# EAGLE design smog_v1_1_brain (EAGLE 7.3.0)

## Sheet 1 of 2
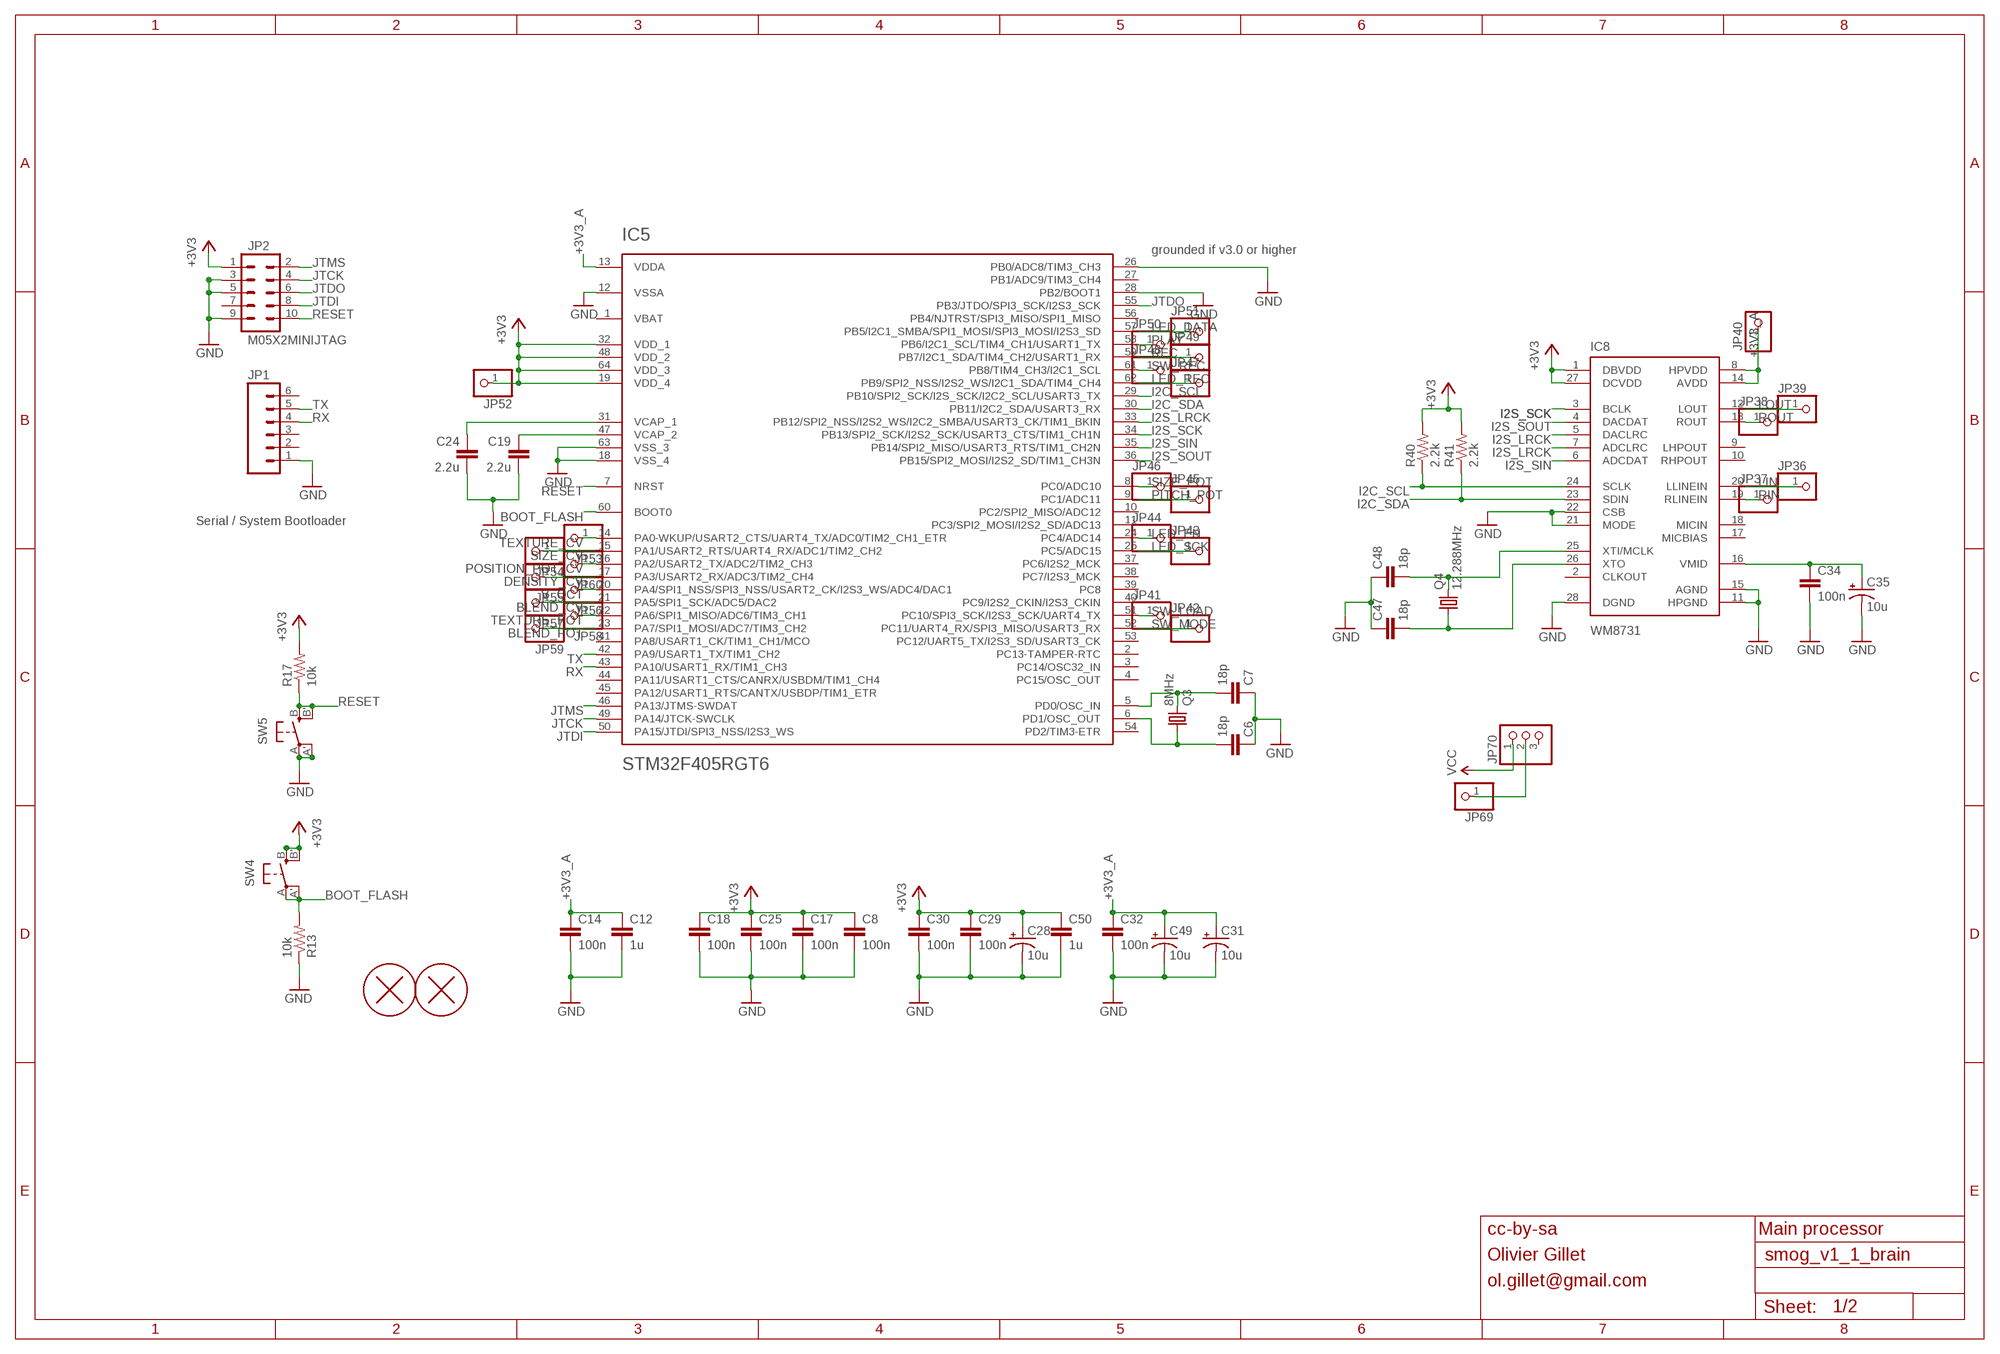
[diagram p0: schematic, sheet 1]

### Parts
C6  18p  CAPACITOR  [RESISTOR_0603]
C7  18p  CAPACITOR  [RESISTOR_0603]
C8  100n  CAPACITOR  [RESISTOR_0603]
C12  1u  CAPACITOR  [RESISTOR_0603]
C14  100n  CAPACITOR  [RESISTOR_0603]
C17  100n  CAPACITOR  [RESISTOR_0603]
C18  100n  CAPACITOR  [RESISTOR_0603]
C19  2.2u  CAPACITOR  [RESISTOR_0603]
C24  2.2u  CAPACITOR  [RESISTOR_0603]
C25  100n  CAPACITOR  [RESISTOR_0603]
C28  10u  CAP_POL  [PANASONIC_B]
C29  100n  CAPACITOR  [RESISTOR_0603]
C30  100n  CAPACITOR  [RESISTOR_0603]
C31  10u  CAP_POL  [PANASONIC_B]
C32  100n  CAPACITOR  [RESISTOR_0603]
C34  100n  CAPACITOR  [RESISTOR_0603]
C35  10u  CAP_POL  [PANASONIC_B]
C47  18p  CAPACITOR  [RESISTOR_0603]
C48  18p  CAPACITOR  [RESISTOR_0603]
C49  10u  CAP_POL  [PANASONIC_B]
C50  1u  CAPACITOR  [RESISTOR_0603]
H1  PCB_SCREW  [PCB_SCREW]
H2  PCB_SCREW  [PCB_SCREW]
IC5  STM32F405RGT6  STM32F20X  [TQFP-10X10-64]
IC8  WM8731  [SSOP28]
JP1  M06SIP  [1X06]
JP2  M05X2MINIJTAG  [2X5-1.27]
JP36  PINHD-1X1  [1X01]
JP37  PINHD-1X1  [1X01]
JP38  PINHD-1X1  [1X01]
JP39  PINHD-1X1  [1X01]
JP40  PINHD-1X1  [1X01]
JP41  PINHD-1X1  [1X01]
JP42  PINHD-1X1  [1X01]
JP43  PINHD-1X1  [1X01]
JP44  PINHD-1X1  [1X01]
JP45  PINHD-1X1  [1X01]
JP46  PINHD-1X1  [1X01]
JP47  PINHD-1X1  [1X01]
JP48  PINHD-1X1  [1X01]
JP49  PINHD-1X1  [1X01]
JP50  PINHD-1X1  [1X01]
JP51  PINHD-1X1  [1X01]
JP52  PINHD-1X1  [1X01]
JP53  PINHD-1X1  [1X01]
JP54  PINHD-1X1  [1X01]
JP55  PINHD-1X1  [1X01]
JP56  PINHD-1X1  [1X01]
JP57  PINHD-1X1  [1X01]
JP58  PINHD-1X1  [1X01]
JP59  PINHD-1X1  [1X01]
JP60  PINHD-1X1  [1X01]
JP69  PINHD-1X1  [1X01]
JP70  PINHD-1X3  [1X03]
Q3  8MHz  CRYSTAL  [HC49UP]
Q4  12.288MHz  CRYSTAL  [HC49UP]
R13  10k  RESISTOR  [RESISTOR_0603]
R17  10k  RESISTOR  [RESISTOR_0603]
R40  2.2k  RESISTOR  [RESISTOR_0603]
R41  2.2k  RESISTOR  [RESISTOR_0603]
SW4  EVQQ2  [EVQ-Q2]
SW5  EVQQ2  [EVQ-Q2]

### Nets
+3V3 [mwide]: C8.1 C17.1 C18.1 C25.1 C28.+ C29.1 C30.1 C50.1 IC5.19(VDD_4) IC5.32(VDD_1) IC5.48(VDD_2) IC5.64(VDD_3) IC8.1(DBVDD) IC8.27(DCVDD) JP2.1 JP52.1 R17.2 R40.2 R41.2 SW4.B'(S1) SW4.B(S) ; also sheet 2
+3V3_A [mwide]: C12.1 C14.1 C31.+ C32.1 C49.+ IC5.13(VDDA) IC8.8(HPVDD) IC8.14(AVDD) JP40.1 ; also sheet 2
BLEND_CV: IC5.21(PA5/SPI1_SCK/ADC5/DAC2) JP57.1
BLEND_POT: IC5.23(PA7/SPI1_MOSI/ADC7/TIM3_CH2) JP59.1
BOOT_FLASH: IC5.60(BOOT0) R13.2 SW4.A'(P1) SW4.A(P)
DENSITY_CV: IC5.17(PA3/USART2_RX/ADC3/TIM2_CH4) JP55.1
GND: C6.1 C7.1 C8.2 C12.2 C14.2 C17.2 C18.2 C19.2 C24.2 C25.2 C28.- C29.2 C30.2 C31.- C32.2 C34.2 C35.- C47.1 C48.1 C49.- C50.2 IC5.12(VSSA) IC5.18(VSS_4) IC5.26(PB0/ADC8/TIM3_CH3) IC5.28(PB2/BOOT1) IC5.63(VSS_3) IC8.11(HPGND) IC8.15(AGND) IC8.21(MODE) IC8.22(CSB) IC8.28(DGND) JP1.1 JP2.3 JP2.5 JP2.9 R13.1 SW5.A'(P1) SW5.A(P) ; also sheet 2
I2C_SCL: IC5.29(PB10/SPI2_SCK/I2S_SCK/I2C2_SCL/USART3_TX) IC8.24(SCLK) R40.1
I2C_SDA: IC5.30(PB11/I2C2_SDA/USART3_RX) IC8.23(SDIN) R41.1
I2S_LRCK: IC5.33(PB12/SPI2_NSS/I2S2_WS/I2C2_SMBA/USART3_CK/TIM1_BKIN) IC8.5(DACLRC) IC8.7(ADCLRC)
I2S_SCK: IC5.34(PB13/SPI2_SCK/I2S2_SCK/USART3_CTS/TIM1_CH1N) IC8.3(BCLK)
I2S_SIN: IC5.35(PB14/SPI2_MISO/USART3_RTS/TIM1_CH2N) IC8.6(ADCDAT)
I2S_SOUT: IC5.36(PB15/SPI2_MOSI/I2S2_SD/TIM1_CH3N) IC8.4(DACDAT)
JTCK: IC5.49(PA14/JTCK-SWCLK) JP2.4
JTDI: IC5.50(PA15/JTDI/SPI3_NSS/I2S3_WS) JP2.8
JTDO: IC5.55(PB3/JTDO/SPI3_SCK/I2S3_SCK) JP2.6
JTMS: IC5.46(PA13/JTMS-SWDAT) JP2.2
LED_DATA: IC5.57(PB5/I2C1_SMBA/SPI1_MOSI/SPI3_MOSI/I2S3_SD) JP51.1
LED_EN: IC5.24(PC4/ADC14) JP44.1
LED_REC: IC5.62(PB9/SPI2_NSS/I2S2_WS/I2C1_SDA/TIM4_CH4) JP47.1
LED_SCK: IC5.25(PC5/ADC15) JP43.1
LIN: IC8.20(LLINEIN) JP36.1
LOUT: IC8.12(LOUT) JP39.1
N$7: C7.2 IC5.5(PD0/OSC_IN) Q3.2
N$8: C6.2 IC5.6(PD1/OSC_OUT) Q3.1
N$13: C19.1 IC5.47(VCAP_2)
N$17: C34.1 C35.+ IC8.16(VMID)
N$19: C24.1 IC5.31(VCAP_1)
N$59: C47.2 IC8.26(XTO) Q4.1
N$60: C48.2 IC8.25(XTI/MCLK) Q4.2
N$74: JP69.1 JP70.2
PITCH_POT: IC5.9(PC1/ADC11) JP45.1
PLAY: IC5.58(PB6/I2C1_SCL/TIM4_CH1/USART1_TX) JP50.1
POSITION_POT_CV: IC5.16(PA2/USART2_TX/ADC2/TIM2_CH3) JP60.1
REC: IC5.59(PB7/I2C1_SDA/TIM4_CH2/USART1_RX) JP49.1
RESET: IC5.7(NRST) JP2.10 R17.1 SW5.B'(S1) SW5.B(S)
RIN: IC8.19(RLINEIN) JP37.1
ROUT: IC8.13(ROUT) JP38.1
RX: IC5.43(PA10/USART1_RX/TIM1_CH3) JP1.4
SIZE_CV: IC5.15(PA1/USART2_RTS/UART4_RX/ADC1/TIM2_CH2) JP54.1
SIZE_POT: IC5.8(PC0/ADC10) JP46.1
SW_LOAD: IC5.51(PC10/SPI3_SCK/I2S3_SCK/UART4_TX) JP41.1
SW_MODE: IC5.52(PC11/UART4_RX/SPI3_MISO/USART3_RX) JP42.1
SW_REC: IC5.61(PB8/TIM4_CH3/I2C1_SCL) JP48.1
TEXTURE_CV: IC5.14(PA0-WKUP/USART2_CTS/UART4_TX/ADC0/TIM2_CH1_ETR) JP53.1
TEXTURE_POT: IC5.22(PA6/SPI1_MISO/ADC6/TIM3_CH1) JP58.1
TX: IC5.42(PA9/USART1_TX/TIM1_CH2) JP1.5
V_OCT: IC5.20(PA4/SPI1_NSS/SPI3_NSS/USART2_CK/I2S3_WS/ADC4/DAC1) JP56.1
VCC [wide]: JP70.1 ; also sheet 2
Unconnected: IC5.2(PC13-TAMPER-RTC) IC5.3(PC14/OSC32_IN) IC5.4(PC15/OSC_OUT) IC5.10(PC2/SPI2_MISO/ADC12) IC5.11(PC3/SPI2_MOSI/I2S2_SD/ADC13) IC5.27(PB1/ADC9/TIM3_CH4) IC5.37(PC6/I2S2_MCK) IC5.38(PC7/I2S3_MCK) IC5.39(PC8) IC5.40(PC9/I2S2_CKIN/I2S3_CKIN) IC5.41(PA8/USART1_CK/TIM1_CH1/MCO) IC5.44(PA11/USART1_CTS/CANRX/USBDM/TIM1_CH4) IC5.45(PA12/USART1_RTS/CANTX/USBDP/TIM1_ETR) IC5.53(PC12/UART5_TX/I2S3_SD/USART3_CK) IC5.54(PD2/TIM3-ETR) IC5.56(PB4/NJTRST/SPI3_MISO/SPI1_MISO) IC8.2(CLKOUT) IC8.9(LHPOUT) IC8.10(RHPOUT) IC8.17(MICBIAS) IC8.18(MICIN) JP1.2 JP1.3 JP1.6 JP2.7 JP70.3

### Notes on the sheet
- grounded if v3.0 or higher
- Serial / System Bootloader
- cc-by-sa | Main processor
- Olivier Gillet
- ol.gillet@gmail.com

## Sheet 2 of 2
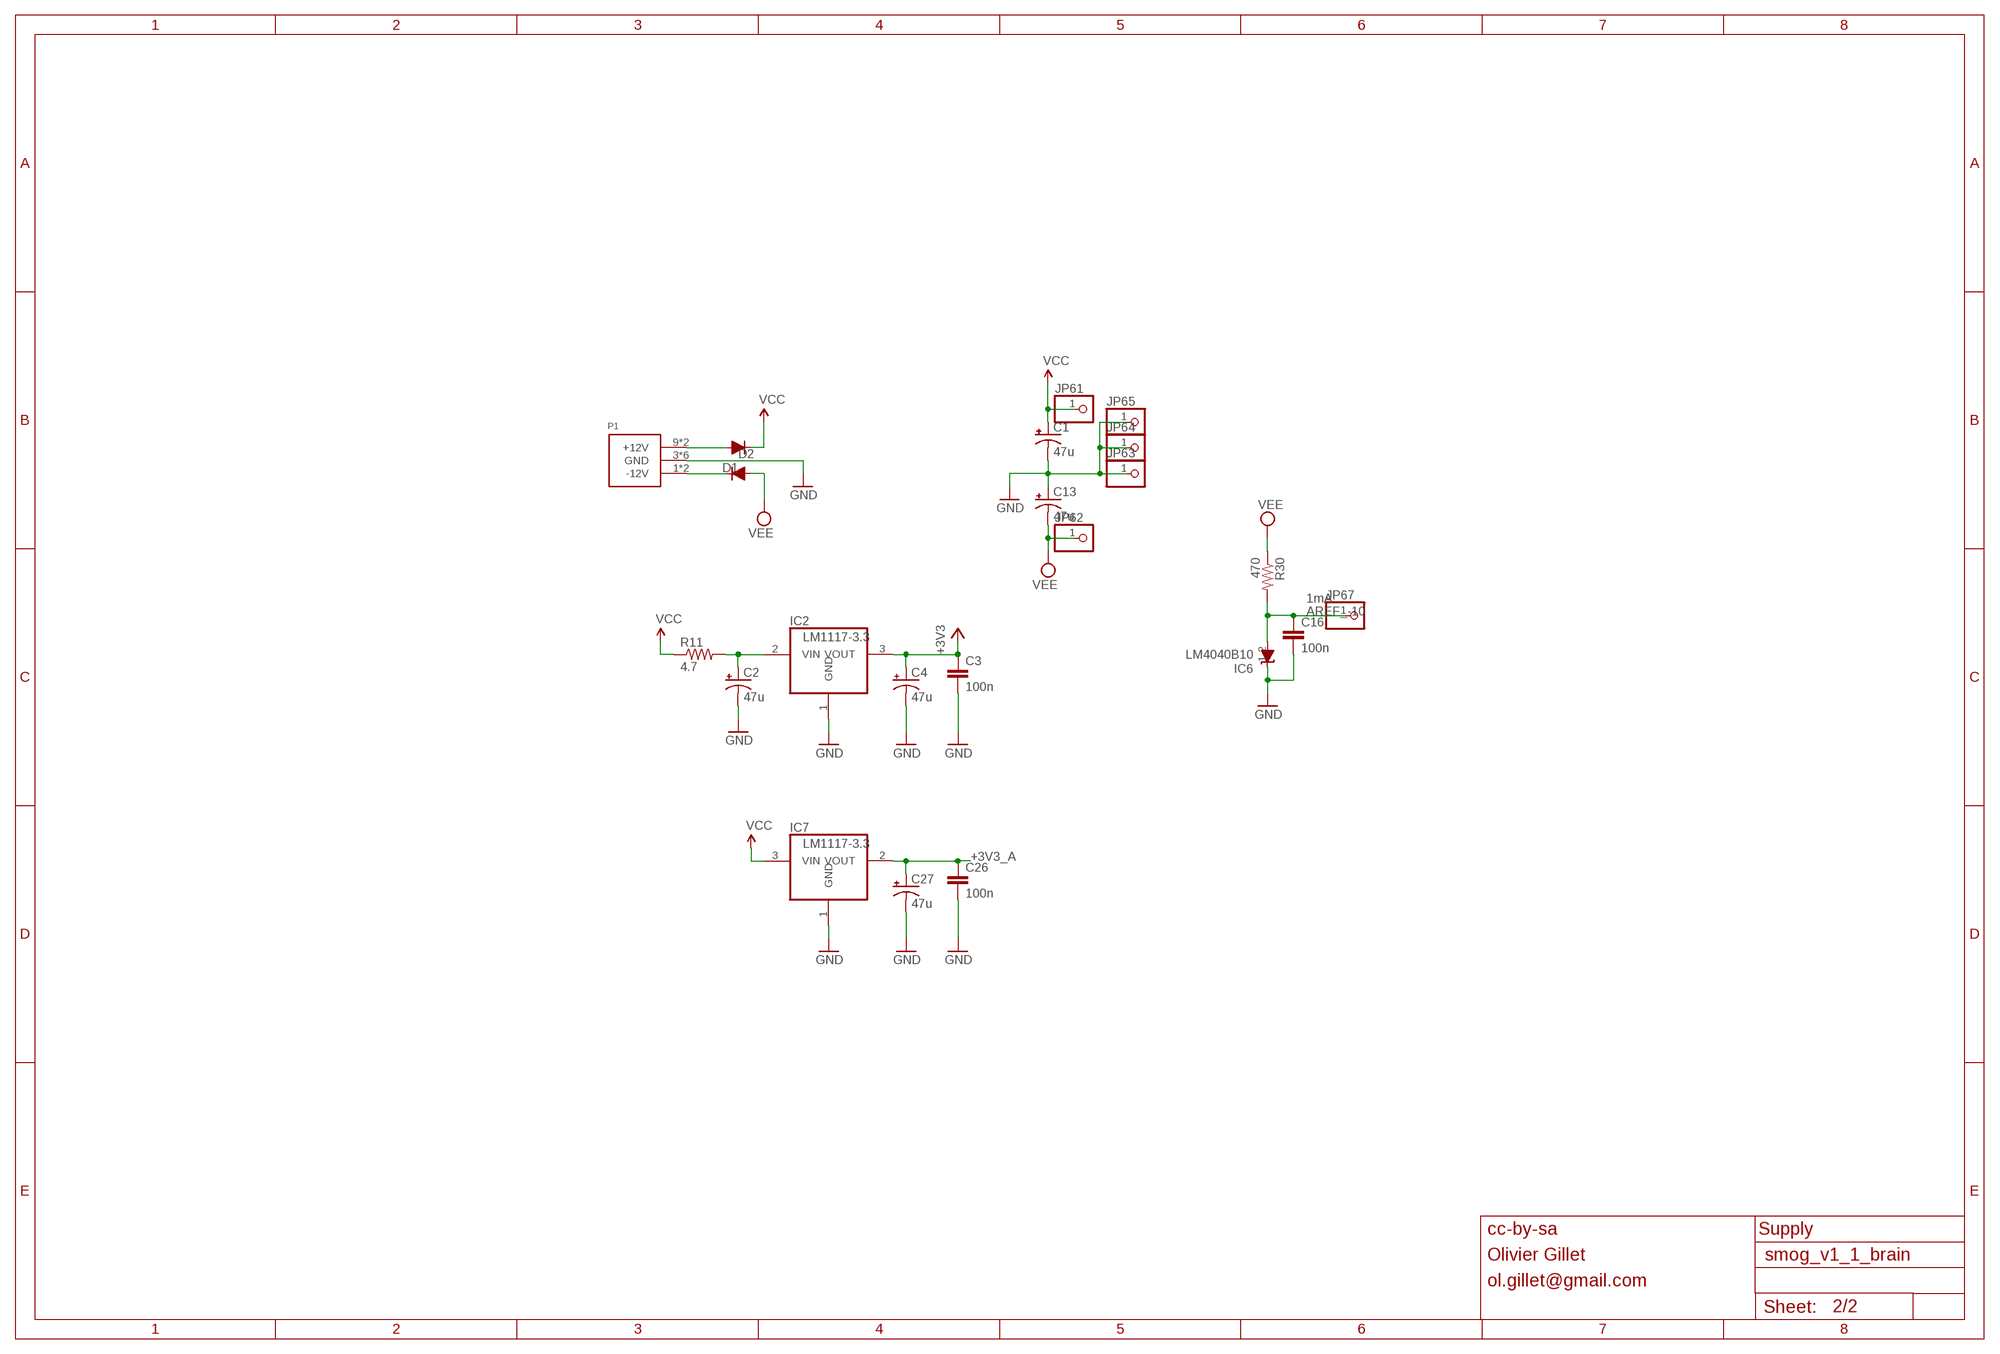
[diagram p1: schematic, sheet 2]

### Parts
C1  47u  CAP_POLD  [PANASONIC_D]
C2  47u  CAP_POLD  [PANASONIC_D]
C3  100n  CAPACITOR  [RESISTOR_0603]
C4  47u  CAP_POLD  [PANASONIC_D]
C13  47u  CAP_POLD  [PANASONIC_D]
C16  100n  CAPACITOR  [RESISTOR_0603]
C26  100n  CAPACITOR  [RESISTOR_0603]
C27  47u  CAP_POLD  [PANASONIC_D]
D1  1N5819HW  DIODE  [SOD123]
D2  1N5819HW  DIODE  [SOD123]
IC2  LM1117-3.3  REG1117T  [TO252]
IC6  LM4040B10  LM4040SOT23  [SOT23]
IC7  LM1117-3.3  REG1117  [SOT223]
JP61  PINHD-1X1  [1X01]
JP62  PINHD-1X1  [1X01]
JP63  PINHD-1X1  [1X01]
JP64  PINHD-1X1  [1X01]
JP65  PINHD-1X1  [1X01]
JP67  PINHD-1X1  [1X01]
P1  POWER_SIMPLE10  [POWER_10]
R11  4.7  RESISTOR  [RESISTOR_0603]
R30  470  RESISTOR  [RESISTOR_0603]

### Nets
+3V3 [mwide]: C3.1 C4.+ IC2.3(VOUT) ; also sheet 1
+3V3_A [mwide]: C26.1 C27.+ IC7.2(VOUT) ; also sheet 1
AREF_-10: C16.1 IC6.2(A) JP67.1 R30.2
GND: C1.- C2.- C3.2 C4.- C13.+ C16.2 C26.2 C27.- IC2.1(GND) IC6.1(C) IC7.1(GND) JP63.1 JP64.1 JP65.1 P1.3(GND) P1.4(GND) P1.5(GND) P1.6(GND) P1.7(GND) P1.8(GND) ; also sheet 1
N$1 [wide]: D1.+ P1.9(+12V) P1.10(+12V)
N$2 [wide]: D2.- P1.1(-12V) P1.2(-12V)
N$55 [wide]: C2.+ IC2.2(VIN) R11.2
VCC [wide]: C1.+ D1.- IC7.3(VIN) JP61.1 R11.1 ; also sheet 1
VEE [wide]: C13.- D2.+ JP62.1 R30.1

### Notes on the sheet
- 1mA
- cc-by-sa | Supply
- Olivier Gillet
- ol.gillet@gmail.com

## Power pins joined to a net without a drawn wire
VBAT: IC5.1(VBAT)

## Library data of the parts
C1 C2 C4 C13 C27 C28 C31 C35 C49 = parts_aman:CAP_POL
C3 C6-C8 C12 C14 C16-C19 C24-C26 C29 C30 C32 C34 C47 C48 C50 = parts_aman:CAPACITOR
D1 D2 = parts_aman:DIODE
H1 H2 = parts_aman:PCB_SCREW
IC2 IC7 = og-vreg:REG1117: 800mA and 1A Low Dropout (LDO) Positive Regulator 1.8V, 2.5V, 2.85V, 3.3V, 5V, and Adj
IC5 = og-stm32f2:STM32F20X
IC6 = parts_aman:LM4040
IC8 = og-dac:WM8731
JP1 = SparkFun:M06: Header 6 Standard 6-pin 0.1" header. Use with straight break away headers (SKU : PRT-00116), right angle break away headers (PRT-00553), swiss pins (PRT-00743), machine pins (PRT-00117), and female headers (PRT-00115). Molex polarized connector foot print use with SKU : PRT-08094 with associated crimp pins and housings. NOTES ON THE VARIANTS LOCK and LOCK_LONGPADS... This footprint was designed to help hold the alignment of a through-hole component (i.e. 6-pin header) while soldering it into place. You may notice that each hole has been shifted either up or down by 0.005 of an inch from it's more standard position (which is a perfectly straight line). This slight alteration caused the pins (the squares in the middle) to touch the edges of the holes. Because they are alternating, it causes a "brace" to hold the component in place. 0.005 has proven to be the perfect amount of "off-center" position when using our standard breakaway headers. Although looks a little odd when you look at the bare footprint, once you have a header in there, the alteration is very hard to notice. Also, if you push a header all the way into place, it is covered up entirely on the bottom side. This idea of altering the position of holes to aid alignment will be further integrated into the Sparkfun Library for other footprints. It can help hold any component with 3 or more connection pins.
JP2 = og-header:M05X2: Header 5x2 Standard 10-pin dual row 0.1" header. Commonly used with AVR-ISP. Use with Spark Fun Electronics SKU: PRT-00778
JP36-JP65 JP67 JP69 = parts_aman:PINHD-1X1: PIN HEADER
JP70 = parts_aman:PINHD-1X3: PIN HEADER
P1 = parts_aman:POWER_SIMPLE
Q3 Q4 = parts_aman:CRYSTAL
R11 R13 R17 R30 R40 R41 = parts_aman:RESISTOR
SW4 SW5 = adafruit:EVQQ2: SMT 6mm switch, EVQQ2 series http://www.ladyada.net/library/eagle

## Net classes
0 default: width 0.152 mm, drill 0.305 mm, clearance 0.152 mm
1 mwide: width 0.229 mm, drill 0.305 mm, clearance 0.152 mm
2 wide: width 0.305 mm, drill 0.305 mm, clearance 0.152 mm

## Board
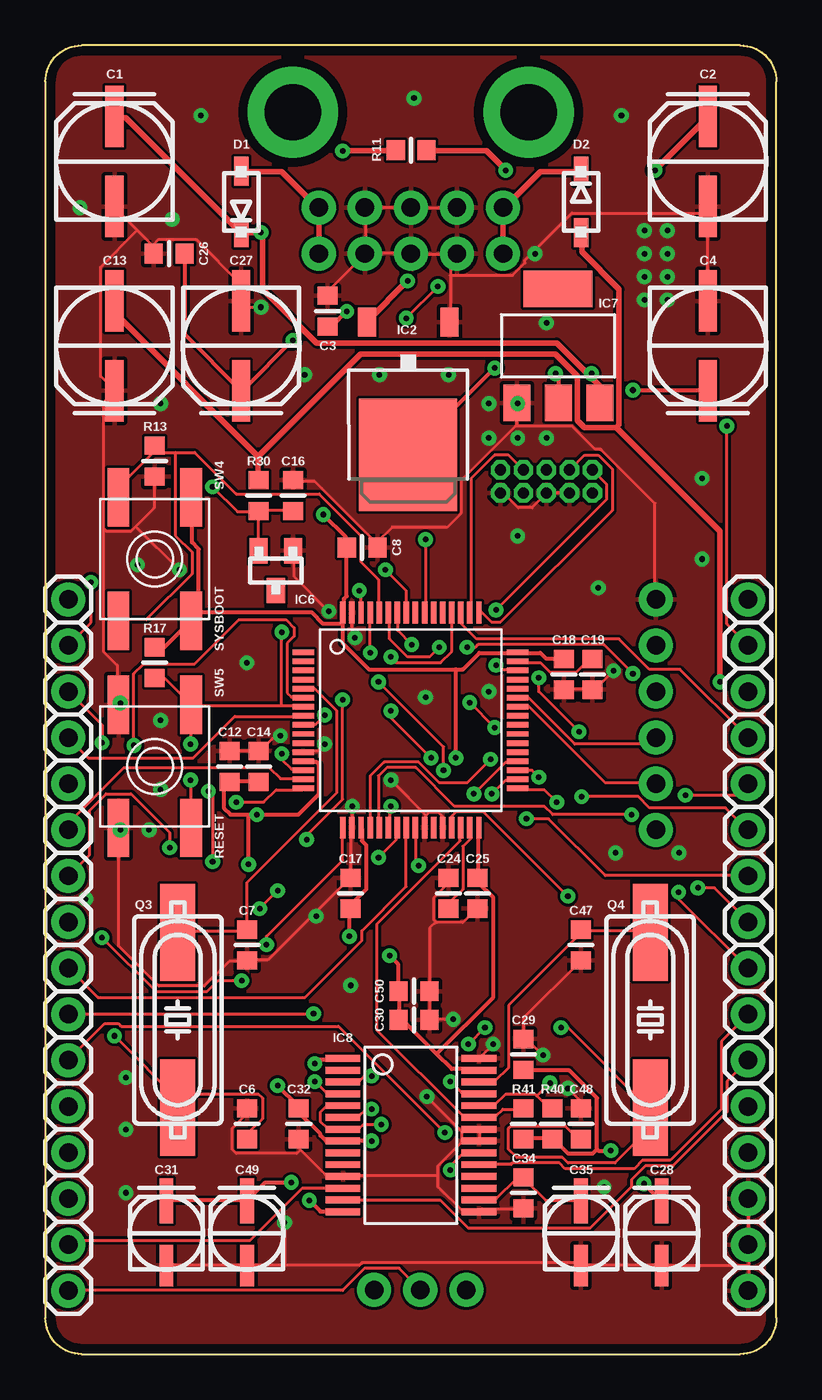
[diagram p2: board, top side]
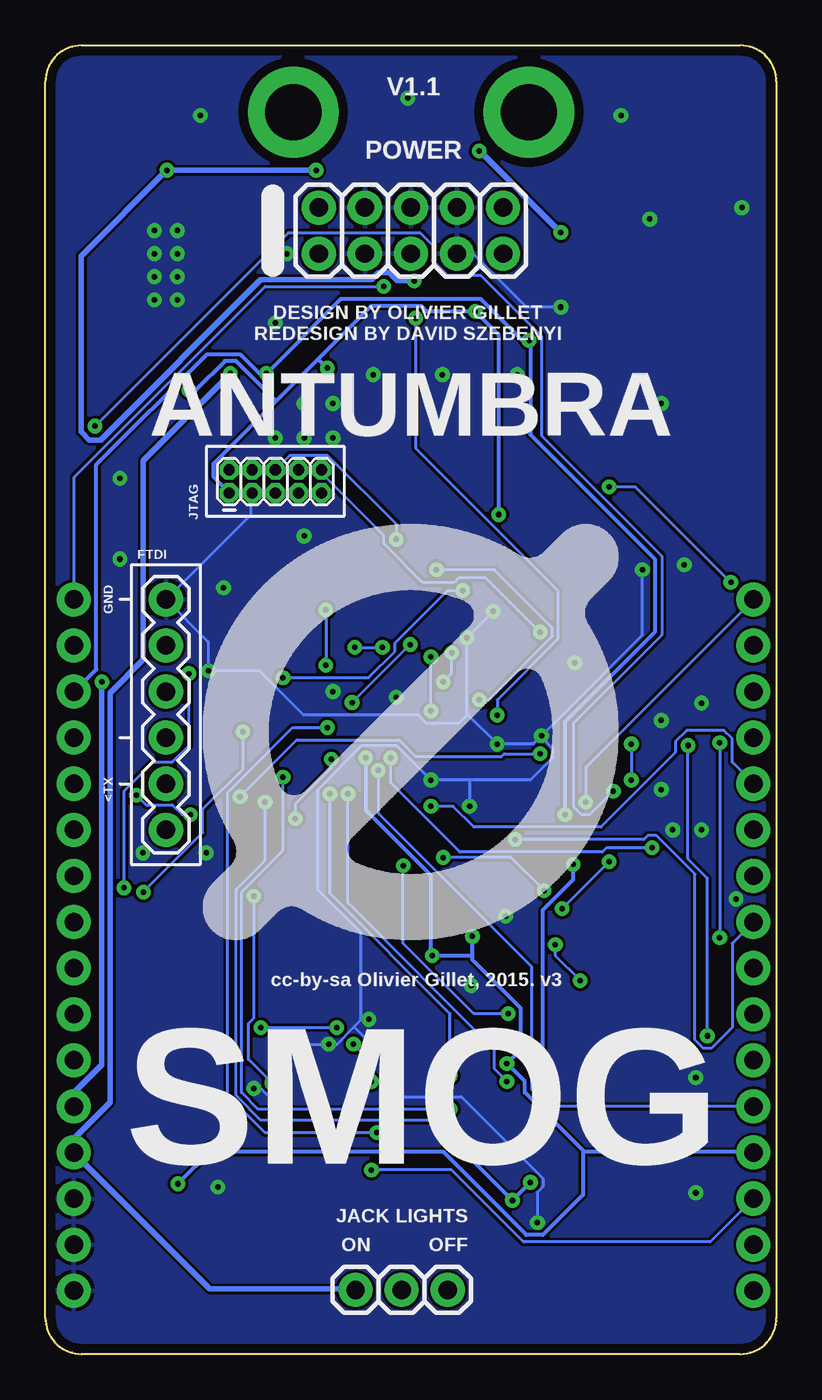
[diagram p3: board, bottom side, seen from below]

Size 40.3 x 72.12 mm. Coordinates in mm from the lower left corner, seen from the top.
Outline: 2,0 38.3,0 arc90 40.3,2 40.3,70.12 arc90 38.3,72.12 2,72.12 arc90 0,70.12 0,2 arc90 2,0
Copper layers (1*16): Top 0.035mm / dielectric 1.5mm / Bottom 0.035mm
Design rules "PCBCart-Standard": minimum track width 6mil, minimum drill 12mil, track to track 6mil, track to pad 6mil, pad to pad 6mil, via to via 6mil, smd to smd 6mil, copper to edge 20mil, drill to drill 8mil, minimum pad ring 8mil, minimum via ring 10mil, stop-mask expansion 3mil, vias tented up to drill 25mil, thermal gap 8mil

### Footprints (pad centres in the part's own frame; a part is rotated, then mirrored left to right if it is on the bottom)
PANASONIC_D = smd 3.4 x 1: + 2.478,0; - -2.478,0
RESISTOR_0603 = smd 1 x 1.1: 1 -0.85,0; 2 0.85,0
PANASONIC_B = smd 2.464 x 0.762: + 1.778,0 | smd 2.286 x 0.762: - -1.778,0
SOD123 = smd 1.6 x 0.8: + 1.7,0; - -1.7,0
PCB_SCREW = drill 3.1 pad 5: P$1 0,0
TO252 = smd 1 x 1.6: 1 -2.28,-4.8; 2 2.28,-4.8 | smd 5.4 x 6.2: 3 0,2.5
TQFP-10X10-64 = smd 1.2 x 0.3: 1 -5.936,3.75; 2 -5.936,3.25; 3 -5.936,2.75; 4 -5.936,2.25; 5 -5.936,1.75; 6 -5.936,1.25; 7 -5.936,0.75; 8 -5.936,0.25; 9 -5.936,-0.25; 10 -5.936,-0.75; 11 -5.936,-1.25; 12 -5.936,-1.75; 13 -5.936,-2.25; 14 -5.936,-2.75; 15 -5.936,-3.25; 16 -5.936,-3.75; 33 5.886,-3.75; 34 5.886,-3.25; 35 5.886,-2.75; 36 5.886,-2.25; 37 5.886,-1.75; 38 5.886,-1.25; 39 5.886,-0.75; 40 5.886,-0.25; 41 5.886,0.25; 42 5.886,0.75; 43 5.886,1.25; 44 5.886,1.75; 45 5.886,2.25; 46 5.886,2.75; 47 5.886,3.25; 48 5.886,3.75 | smd 0.3 x 1.2: 17 -3.75,-5.911; 18 -3.25,-5.911; 19 -2.75,-5.911; 20 -2.25,-5.911; 21 -1.75,-5.911; 22 -1.25,-5.911; 23 -0.75,-5.911; 24 -0.25,-5.911; 25 0.25,-5.911; 26 0.75,-5.911; 27 1.25,-5.911; 28 1.75,-5.911; 29 2.25,-5.911; 30 2.75,-5.911; 31 3.25,-5.911; 32 3.75,-5.911; 49 3.75,5.936; 50 3.25,5.936; 51 2.75,5.936; 52 2.25,5.936; 53 1.75,5.936; 54 1.25,5.936; 55 0.75,5.936; 56 0.25,5.936; 57 -0.25,5.936; 58 -0.75,5.936; 59 -1.25,5.936; 60 -1.75,5.936; 61 -2.25,5.936; 62 -2.75,5.936; 63 -3.25,5.936; 64 -3.75,5.936
SOT23 = smd 1 x 1.4: 1 -0.95,-1.1; 2 0.95,-1.1; 3 0,1.1
SOT223 = smd 1.499 x 2.007: 1 -2.261,-3.15; 2 0.025,-3.15; 3 2.311,-3.15 | smd 3.81 x 2.007: 4 0,3.15
SSOP28 = smd 0.381 x 1.905: 1 -4.55,-3.752; 2 -3.9,-3.752; 3 -3.25,-3.752; 4 -2.6,-3.752; 5 -1.95,-3.752; 6 -1.3,-3.752; 7 -0.65,-3.752; 8 0,-3.752; 9 0.65,-3.752; 10 1.3,-3.752; 11 1.95,-3.752; 12 2.6,-3.752; 13 3.25,-3.752; 14 3.9,-3.752; 15 3.9,3.752; 16 3.25,3.752; 17 2.6,3.752; 18 1.95,3.752; 19 1.3,3.752; 20 0.65,3.752; 21 0,3.752; 22 -0.65,3.752; 23 -1.3,3.752; 24 -1.95,3.752; 25 -2.6,3.752; 26 -3.25,3.752; 27 -3.9,3.752; 28 -4.55,3.752
1X06 = drill 1.016 pad 1.88: 1 0,0; 2 2.54,0; 3 5.08,0; 4 7.62,0; 5 10.16,0; 6 12.7,0
2X5-1.27 = drill 0.61 pad 1.067 octagon: 1 -1.27,3.81; 2 0,3.81; 3 -1.27,2.54; 4 0,2.54; 5 -1.27,1.27; 6 0,1.27; 7 -1.27,0; 8 0,0; 9 -1.27,-1.27; 10 0,-1.27
1X01 = drill 1.016 pad 1.88: 1 0,0
1X03 = drill 1.016 pad 1.88: 1 -2.54,0; 2 0,0; 3 2.54,0
POWER_10 = drill 1.016 pad 1.88: 1 -5.08,-1.27; 2 -5.08,1.27; 3 -2.54,-1.27; 4 -2.54,1.27; 5 0,-1.27; 6 0,1.27; 7 2.54,-1.27; 8 2.54,1.27; 9 5.08,-1.27; 10 5.08,1.27
HC49UP = smd 5.334 x 1.93: 1 -4.826,0; 2 4.826,0
EVQ-Q2 = smd 3.2 x 1.2: A -3.4,-2; A' 3.4,-2; B -3.4,2; B' 3.4,2

### Placement (x,y rotation side)
C1  3.81,65.72 90 top
C2  36.51,65.72 90 top
C3  15.56,57.47 90 top
C4  36.51,55.56 270 top
C6  11.11,12.7 270 top
C7  11.11,22.54 90 top
C8  17.46,44.45 0 top
C12  10.16,32.39 90 top
C13  3.81,55.56 270 top
C14  11.75,32.39 90 top
C16  13.65,47.31 90 top
C17  16.83,25.4 90 top
C18  28.57,37.47 270 top
C19  30.16,37.47 270 top
C24  22.23,25.4 90 top
C25  23.81,25.4 270 top
C26  6.82,60.64 180 top
C27  10.79,55.56 270 top
C28  33.97,6.67 90 top
C29  26.35,16.51 90 top
C30  20.32,18.41 0 top
C31  6.67,6.67 90 top
C32  13.97,12.7 270 top
C34  26.35,8.89 270 top
C35  29.53,6.67 90 top
C47  29.53,22.54 90 top
C48  29.53,12.7 270 top
C49  11.11,6.67 90 top
C50  20.32,20 0 top
D1  10.79,63.5 90 top
D2  29.53,63.5 270 top
H1  13.64,68.44 0 top
H2  26.64,68.44 0 top
IC2  20,52.07 180 top
IC5  20.15,34.92 0 top
IC6  12.7,43.18 180 top
IC7  28.26,55.56 0 top
IC8  20.15,11.75 270 top
JP1  33.66,41.59 270 bottom
JP2  26.35,48.73 90 bottom
JP36  1.27,8.57 0 top
JP37  38.73,18.73 0 top
JP38  38.73,16.19 0 top
JP39  1.27,6.03 0 top
JP40  38.73,36.51 0 top
JP41  38.73,33.97 0 top
JP42  1.27,26.35 0 top
JP43  1.27,18.73 0 top
JP44  1.27,21.27 0 top
JP45  38.73,41.59 0 top
JP46  1.27,33.97 0 top
JP47  38.73,21.27 0 top
JP48  1.27,13.65 0 top
JP49  38.73,23.81 0 top
JP50  1.27,16.19 0 top
JP51  1.27,23.81 0 top
JP52  1.27,11.11 0 top
JP53  38.73,28.89 0 top
JP54  1.27,28.89 0 top
JP55  1.27,36.51 0 top
JP56  38.73,26.35 0 top
JP57  38.73,31.43 0 top
JP58  1.27,31.43 0 top
JP59  38.73,39.05 0 top
JP60  1.27,41.59 0 top
JP61  38.73,11.11 0 top
JP62  38.73,13.65 0 top
JP63  38.73,3.49 0 top
JP64  38.73,8.57 0 top
JP65  38.73,6.03 0 top
JP67  1.27,39.05 0 top
JP69  1.27,3.49 0 top
JP70  20.66,3.54 0 bottom
P1  20.15,61.91 0 bottom
Q3  7.3,18.41 90 top
Q4  33.34,18.41 270 top
R11  20.17,66.36 0 top
R13  6.03,49.21 90 top
R17  6.03,38.1 90 top
R30  11.75,47.31 270 top
R40  27.94,12.7 270 top
R41  26.35,12.7 270 top
SW4  6.03,43.81 270 top
SW5  6.03,32.39 270 top
U$1  [LOGO_23]  20.15,34.29 0 bottom

### Tracks (layer width: path | path; a pad name or v marks a point on that pad's centre or on a via)
+3V3  (via drill 0.3)
  Top 0.229: R17.2 6.1,38.95 6.55,38.95 8,40.4 SW4.B' | SW4.B 8.08,47.18 8.08,44.74 8.46,44.36 8.46,40.86 8.08,40.47 SW4.B' | C18.1 28.57,38.34 27.58,38.34 27.28,38.65 26.06,38.65 IC5.48 25.98,38.65 23.93,38.65 23.01,37.73 22.63,37.73 | 22.63,37.73 17.83,37.73 16.38,39.18 16.38,40.25 | 16.38,40.25 16.38,40.78 IC5.64 16.46,40.93 16.46,41.62 16.61,41.77 16.61,44.44 C8.1 16.54,44.51 16.54,45.05 v15.32,46.27 | 16.38,40.25 15.32,40.25 14.71,40.86 8.53,40.86 SW4.B' | v16.61,57.47 15.77,56.63 15.62,56.63 C3.1 | v32.38,53.12 36.5,53.12 C4.+ | v24.77,54.34 20.04,49.62 IC2.3 | IC5.32 23.85,28.97 23.85,26.3 C25.1 23.85,26.15 23.85,26 24.69,25.16 24.69,19.67 21.57,16.55 | 21.57,16.55 22.4,15.71 23.85,15.71 IC8.27 | 21.57,16.55 19.74,18.38 19.58,18.38 C30.1 19.51,18.45 19.51,19.98 C50.1 19.43,20.05 19.43,21.5 v18.97,21.96 | R41.2 26.36,11.9 27.89,11.9 R40.2 28.04,11.82 28.8,11.06 30.18,11.06 30.4,11.29 | 30.4,11.29 30.4,14.11 28.88,15.63 26.36,15.63 C29.1 | v32.99,9.39 33.91,8.47 C28.+ | v31.17,11.21 30.48,11.21 30.4,11.29 | IC5.19 17.45,28.97 17.45,28.28 17.68,28.05 17.68,25.62 16.84,24.78 16.84,24.63 C17.1 16.76,24.47 v16.76,23.03 | v14.86,16.01 15.09,16.24 16.38,16.24 IC8.1 | v22.63,32.85 22.63,37.73
  Bottom 0.229: 27.58,52.51 31.01,49.09 31.01,48.32 30.18,47.49 JP2.1 | 27.58,52.51 25.26,54.84 | 25.26,54.84 22.33,57.77 19.58,57.77 19.28,57.47 v16.61,57.47 15.32,56.17 v15.32,46.27 | v32.38,53.12 32,53.12 30.4,54.72 29.79,54.72 27.58,52.51 | 25.26,54.84 v24.77,54.34 | v32.99,9.39 v31.17,11.21 31.09,11.14 18.36,11.14 13.79,6.57 12.88,6.57 10.67,8.78 10.67,11.06 10.59,11.14 | 10.59,11.14 13.87,14.41 13.87,15.02 v14.86,16.01 14.1,16.78 14.1,19.06 16.76,21.73 16.76,21.96 | 10.59,11.14 1.29,11.14 JP52.1 | 16.76,21.96 v16.76,23.03 | 16.76,21.96 v18.97,21.96 19.05,22.03 19.05,26.38 22.63,29.96 v22.63,32.85
+3V3_A  (via drill 0.3)
  Top 0.229: C14.1 11.73,31.56 10.21,31.56 C12.1 10.06,31.48 9.83,31.25 9.83,30.11 10.21,29.73 11.2,29.73 | 11.2,29.73 v11.66,29.73 13.95,29.73 15.09,30.87 15.09,32.47 14.94,32.63 14.25,32.63 IC5.13 | v14.55,8.47 15.16,7.86 16.38,7.86 IC8.14 | v13.56,9.46 12.12,9.46 11.12,8.47 C49.+ 11.05,8.47 6.71,8.47 C31.+ | v17.98,11.75 IC8.8 15.47,11.75 15.16,12.05 15.16,12.13 14.02,13.27 14.02,13.5 C32.1 13.95,13.65 v12.8,14.8 | v11.2,26.99 11.2,29.73 | C26.1 7.7,60.59 7.7,56.17 10.74,53.12 C27.+ 10.9,53.12 v13.64,55.87 | v28.12,54.04 28.27,53.89 28.27,52.44 IC7.2
  Bottom 0.229: v13.56,9.46 v14.55,8.47 17.83,11.75 v17.98,11.75 | v11.2,26.99 11.2,26.15 12.88,24.47 12.88,14.87 v12.8,14.8 | JP40.1 38.71,36.51 37.49,37.73 37.49,49.01 31.39,55.11 29.57,55.11 28.5,54.04 v28.12,54.04 24,58.15 16.31,58.15 14.02,55.87 v13.64,55.87 13.56,55.79 13.56,50.69 6.71,43.83 6.71,39.79 11.66,34.84 v11.66,29.73
AREF_-10  (via drill 0.3)
  Top 0.152: R30.2 11.81,46.49 13.64,46.49 C16.1 | IC6.2 11.73,44.28 11.73,46.42 R30.2 | v9.22,47.79 10.59,46.42 11.66,46.42 R30.2 | v2.52,42.53 2.52,40.32 1.29,39.1 JP67.1
  Bottom 0.152: v9.22,47.79 7.77,47.79 v2.52,42.53
BLEND_CV  (via drill 0.3)
  Top 0.152: v32.31,29.73 27.96,29.73 27.51,30.19 22.55,30.19 20.42,32.32 18.82,32.32 18.36,31.86 18.36,29.04 IC5.21 | v35.28,30.8 38.1,30.8 JP57.1
  Bottom 0.152: v32.31,29.73 32.77,29.73 33.3,30.26 34.75,30.26 v35.28,30.8
BLEND_POT  (via drill 0.3)
  Top 0.152: v18.36,27.37 19.36,28.36 19.36,28.97 IC5.23 | v11.81,24.55 v12.8,25.54 | v9.22,27.14 9.22,30.8 v8.99,31.03 | v37.57,51.14 37.57,40.25 38.71,39.1 JP59.1
  Bottom 0.152: v18.36,27.37 14.63,27.37 v12.8,25.54 | v9.22,27.14 v11.81,24.55 | v8.99,31.03 10.29,29.73 10.74,29.73 11.2,30.19 11.2,34.76 6.33,39.64 6.33,43.98 12.95,50.61 12.95,56.1 16.31,59.45 18.14,59.45 18.97,60.29 18.97,61.13 19.66,61.81 26.9,61.81 v37.57,51.14
BOOT_FLASH
  Top 0.152: SW4.A 4.04,47.26 4.04,47.79 6.02,49.77 6.02,50 R13.2 6.02,49.7 7.16,49.7 | 7.16,49.7 8.23,49.7 10.52,47.41 15.09,47.41 17.37,45.12 17.37,43.68 18.36,42.68 18.36,40.93 IC5.60 | 7.16,49.7 7.16,45.12 8.08,44.21 8.08,42.99 5.56,40.47 4.04,40.47 SW4.A'
DENSITY_CV  (via drill 0.3)
  Top 0.152: v12.19,22.57 12.19,23.03 16.38,27.22 16.38,28.97 IC5.17 | v10.82,20.59 9.53,20.59 8.91,19.98 6.1,19.98 v3.12,22.95 | v3.12,33.69 3.12,34.68 1.29,36.51 JP55.1
  Bottom 0.152: v12.19,22.57 12.19,21.96 v10.82,20.59 | v3.12,33.69 v3.12,22.95
GND  (via drill 0.3)
  Top 0.152: 17.68,63.18 P1.6 P1.4 | 36.5,62.88 36.5,63.18 C2.- 36.5,62.88 | 36.5,62.88 36.5,58.08 C4.- | C3.2 15.62,58.38 15.62,58.61 17.6,60.59 P1.7 | 22.33,59.45 22.33,60.29 22.63,60.59 P1.3 22.33,60.36 22.1,60.59 20.19,60.59 P1.5 20.12,60.67 17.68,60.67 P1.7 | 22.33,59.45 22.33,56.93 IC2.1 | 36.5,62.88 29.03,62.88 26.44,60.29 26.44,60.13 25.76,59.45 22.33,59.45 | 17.68,63.18 17.68,60.74 P1.7 | 17.68,63.18 P1.8 | 5.07,61.93 3.81,63.18 C1.- | 5.07,61.93 5.94,61.05 5.94,60.67 C26.2 5.94,61.13 6.25,61.43 8.31,61.43 10.74,58.99 10.74,58.08 C27.- 10.82,58 11.12,57.7 v11.89,57.7 | 4.99,45.62 4.72,45.35 3.35,45.35 3.24,45.47 | 4.99,45.62 6.02,46.65 6.02,48.32 R13.1 | 3.24,45.47 3.2,45.5 3.2,52.44 3.81,53.05 C13.+ 3.81,53.12 3.05,53.89 3.05,59.91 5.07,61.93 | SW5.A 3.96,35.83 3.96,37.96 3.2,38.72 3.2,45.43 3.24,45.47 | 38.79,6.03 38.79,4.89 | 38.79,4.89 38.79,3.52 JP63.1 | 38.79,6.03 38.79,8.55 JP64.1 | 38.79,6.03 JP65.1 | C31.- C49.- 13.18,4.89 | 13.18,4.89 17.3,4.89 17.45,5.04 29.34,5.04 29.49,4.89 C35.- C28.- 38.79,4.89 | C16.2 13.72,48.09 14.86,48.09 18.29,44.67 18.29,44.51 C8.2 18.29,44.74 19.13,45.58 22.17,45.58 22.94,46.34 22.94,48.17 25.95,51.18 | 25.95,51.18 25.98,51.22 25.98,52.36 IC7.1 | JP2.9 25.15,47.41 25.3,47.41 26.06,46.65 26.82,46.65 27.58,47.41 JP2.5 27.66,47.49 28.88,47.49 JP2.3 | C18.2 28.57,36.66 30.1,36.66 C19.2 30.18,36.66 30.33,36.66 v31.32,37.66 | 25.95,51.18 25.98,51.14 29.03,51.14 30.33,49.85 30.63,49.85 33.6,46.88 33.6,41.62 JP1.1 | SW5.A' 4.04,28.97 4.04,22.49 6.25,20.28 8.76,20.28 10.13,21.65 11.05,21.65 C7.1 11.12,21.73 12.27,21.73 16.76,26.23 C17.2 16.84,26.3 16.84,28.97 IC5.18 16.92,29.04 v16.92,30.19
  Top 0.152: IC8.22 23.93,12.36 23.93,11.75 IC8.21 23.01,11.75 22.97,11.71 | C34.2 26.29,8.01 24.08,8.01 23.93,7.86 IC8.15 23.85,7.86 23.01,7.86 21.64,9.23 21.64,9.84 | 22.97,11.71 21.64,10.38 21.64,9.84 | 14.06,11.25 15.47,9.84 16.38,9.84 IC8.11 16.46,9.84 21.64,9.84 | 14.06,11.25 14.02,11.29 14.02,11.82 C32.2 | 14.06,11.25 13.87,11.06 10.52,11.06 10.29,11.29 10.29,12.43 11.05,13.2 11.05,13.5 C6.1 | 21.53,23.83 21.57,23.79 23.01,23.79 23.77,24.55 C25.2 | 21.53,23.83 21.41,23.94 21.41,25.16 22.17,25.92 22.17,26.23 C24.2 | 21.53,23.83 21.18,23.48 21.18,20.05 C50.2 21.18,19.98 21.18,18.45 C30.2 21.26,18.45 v22.48,18.45 | C47.1 29.49,21.65 26.36,18.53 26.36,17.39 C29.2 26.44,17.39 26.52,17.39 v27.43,16.47 | v28.8,14.64 29.49,13.96 29.49,13.58 C48.1 | v24.69,17.08 23.93,16.32 IC8.28 | 20.99,29.69 21.18,29.88 21.64,29.88 21.87,29.65 21.87,29.04 IC5.28 | 20.99,29.69 20.95,29.65 20.95,29.04 IC5.26 | C12.2 10.21,33.24 11.73,33.24 C14.2 11.81,33.24 12.65,34.07 v12.95,34.07 | v15.39,33.62 15.01,33.24 14.25,33.24 IC5.12 | v17.07,39.48 16.92,39.64 16.92,40.86 IC5.63 | v15.62,40.93 13.72,42.84 13.72,44.21 IC6.1 | v19.05,31.64 20.99,29.69 | v21.03,14.19 22.94,12.28 22.94,11.75 22.97,11.71 | v13.18,7.25 13.18,4.89 | v7.39,43.22 4.99,45.62
  Bottom 0.152: v11.89,57.7 13.79,57.7 16.69,60.59 17.6,60.59 P1.7 | JP2.3 28.96,47.41 28.96,46.27 33.6,41.62 JP1.1 31.32,39.26 v31.32,37.66 28.5,37.66 26.06,35.22 19.74,35.22 19.28,34.76 17.53,34.76 17.03,35.26 | v28.8,14.64 28.42,14.64 28.04,14.26 27.58,14.26 27.13,14.72 27.13,16.17 v27.43,16.47 27.13,16.24 26.29,17.08 v24.69,17.08 24.23,17.08 23.28,18.03 | v22.48,18.45 22.86,18.45 22.9,18.41 | 23.28,18.03 22.9,18.41 | v12.95,34.07 13.41,33.62 v15.39,33.62 17.03,35.26 | 17.03,35.26 17.07,35.29 v17.07,39.48 v15.62,40.93 | 16.92,31.64 13.56,31.64 12.34,32.85 12.34,33.39 12.95,34 v12.95,34.07 | 16.92,31.64 v19.05,31.64 20.95,33.54 22.86,33.54 25.3,31.1 25.3,25.62 22.94,23.25 22.94,18.45 22.9,18.41 | 23.28,18.03 21.03,15.79 v21.03,14.19 17.37,14.19 12.88,9.69 12.88,9.23 13.18,8.93 v13.18,7.25 | 16.92,31.64 v16.92,30.19 | v7.39,43.22 7.39,39.64 v12.95,34.07
  other vias: 4.45,8.89 4.45,12.38 4.45,15.24 30.8,9.21 31.43,27.62 34.92,27.62 6.35,34.92 11.11,38.1 20.95,36.2 5.08,43.5 18.41,53.98 22.23,53.98 27.62,50.48 14.29,53.98 27.62,56.83 36.2,48.26 36.2,43.81 24.45,36.51 31.75,68.26 8.57,68.26 26.99,60.64 14.92,24.13 16.83,20.32 5.71,28.89 6.35,31.12 2.22,25.08 4.13,28.89 4.13,35.88 6.35,52.39 26.04,52.39 33.02,61.91 6.99,62.55 1.91,63.18 20.32,69.22 26.04,45.09 30.48,42.23 34.29,58.1 34.29,59.37 34.29,60.64 33.02,60.64 33.02,59.37 33.02,58.1 34.29,61.91 24.45,52.39 24.45,50.48 26.04,50.48
  pour Top: -0.32,-0.32 40.32,-0.32 40.32,72.07 40.32,72.39 -0.32,72.39
  pour Bottom: -0.32,-0.32 40.32,-0.32 40.32,72.07 40.32,72.39 -0.32,72.39
I2C_SCL  (via drill 0.3)
  Top 0.152: 27.09,14.22 26.98,14.34 25.38,14.34 24.77,13.73 23.93,13.73 IC8.24 | 27.09,14.22 27.74,13.58 27.89,13.58 R40.1 | v28.8,25.23 24.16,29.88 22.63,29.88 22.4,29.65 22.4,29.04 IC5.29 | 27.09,14.22 v27.81,14.95
  Bottom 0.152: v28.8,25.23 28.8,18.53 29.11,18.22 29.11,16.24 v27.81,14.95
I2C_SDA
  Top 0.152: R41.1 26.29,13.5 25.22,13.5 24.84,13.12 23.93,13.12 IC8.23 23.85,13.12 23.01,13.12 18.29,17.84 18.29,23.71 22.86,28.28 22.86,28.97 IC5.30
I2S_LRCK  (via drill 0.3)
  Top 0.152: v28.19,30.42 27.51,31.1 26.06,31.1 IC5.33 | v18.52,12.66 17.53,12.66 17.3,12.43 16.46,12.43 IC8.7 16.38,12.43 15.54,12.43 15.16,12.81 15.16,13.35 15.47,13.65 16.38,13.65 IC8.5
  Bottom 0.152: v28.19,30.42 28.19,27.22 29.79,25.62 29.79,14.26 28.42,12.89 18.75,12.89 v18.52,12.66
I2S_SCK  (via drill 0.3)
  Top 0.152: v24.61,30.87 25.38,31.64 25.98,31.64 IC5.34 | v17.98,15.33 17.6,15.33 17.3,15.02 16.46,15.02 IC8.3
  Bottom 0.152: v24.61,30.87 24.61,25.39 17.98,18.76 v17.98,15.33
I2S_SIN  (via drill 0.3)
  Top 0.152: v27.2,31.79 26.82,32.17 26.06,32.17 IC5.35 | v17.98,13.5 17.68,13.5 17.3,13.12 16.46,13.12 IC8.6
  Bottom 0.152: v27.2,31.79 27.2,27.75 29.49,25.46 29.49,14.41 28.57,13.5 v17.98,13.5
I2S_SOUT  (via drill 0.3)
  Top 0.152: v23.62,30.87 25.38,32.63 25.98,32.63 IC5.36 | v14.86,15.02 15.47,14.41 16.38,14.41 IC8.4
  Bottom 0.152: v23.62,30.87 23.62,24.85 15.54,16.78 15.54,15.71 v14.86,15.02
JTCK
  Top 0.152: IC5.49 23.93,40.86 24.08,40.86 24.61,40.32 25.07,40.32 31.24,46.49 31.24,48.78 30.48,49.54 29.72,49.54 28.96,48.78 JP2.4
JTDI
  Top 0.152: IC5.50 23.47,40.93 23.47,48.25 24.77,49.54 25.53,49.54 26.29,48.78 JP2.8
JTDO  (via drill 0.3)
  Top 0.152: v20.95,44.89 20.95,40.93 IC5.55
  Bottom 0.152: v20.95,44.89 20.95,45.73 24.77,49.54 26.82,49.54 27.58,48.78 JP2.6
JTMS  (via drill 0.3)
  Top 0.152: v24.84,37.96 25.07,37.73 25.98,37.73 IC5.46 | v24.84,41.01 30.94,47.1 30.94,47.94 30.18,48.7 JP2.2
  Bottom 0.152: v24.84,41.01 v24.84,37.96
LED_DATA  (via drill 0.3)
  Top 0.152: v18.75,43.22 19.89,42.08 19.89,40.93 IC5.57 | v16.38,36.06 16.38,30.57 14.4,28.59 v14.4,28.36
  Bottom 0.152: v18.75,43.22 15.54,43.22 12.34,40.02 12.34,39.56 15.85,36.06 v16.38,36.06 | v14.4,28.36 7.32,28.36 7.09,28.59 6.63,28.59 4.5,26.45 4.5,17.31 4.04,16.85 3.58,16.85 2.44,18 2.44,22.64 JP51.1
LED_EN
  Top 0.152: IC5.24 19.89,28.97 19.89,25.77 17.45,23.33 17.45,22.8 14.33,19.67 2.9,19.67 1.29,21.27 JP44.1
LED_REC  (via drill 0.3)
  Top 0.152: v17.3,42.08 17.37,42 17.37,40.93 IC5.62 | v27.2,37.27 27.2,36.51 v29.41,34.3 | v34.9,25.46 34.9,25.08 38.71,21.27 JP47.1
  Bottom 0.152: v17.3,42.08 18.14,42.08 21.03,39.18 21.03,38.72 22.48,37.27 v27.2,37.27 | v29.41,34.3 29.41,32.25 31.62,30.04 31.62,28.74 v34.9,25.46
LED_SCK  (via drill 0.3)
  Top 0.152: v20.57,26.91 20.42,27.06 20.42,28.97 IC5.25 | v14.78,18.76 1.29,18.76 JP43.1
  Bottom 0.152: v20.57,26.91 20.57,22.64 16.69,18.76 v14.78,18.76
LIN  (via drill 0.3)
  Top 0.152: v22.33,10.15 22.33,10.38 23.01,11.06 23.85,11.06 IC8.20
  Bottom 0.152: v22.33,10.15 17.91,10.15 13.95,6.18 3.66,6.18 JP36.1
LOUT
  Top 0.152: IC8.12 16.38,9.16 14.17,9.16 11.28,6.26 1.52,6.26 1.29,6.03 JP39.1
N$1
  Top 0.305: D1.+ 10.82,65.16 13.03,65.16 15.01,63.18 P1.10 15.09,63.11 15.09,60.67 P1.9
N$2
  Top 0.305: D2.- 29.49,65.16 27.28,65.16 25.3,63.18 P1.2 25.22,63.11 25.22,60.67 P1.1
N$7
  Top 0.152: Q3.2 7.39,23.33 11.05,23.33 C7.2 11.12,23.41 11.12,26 16.08,30.95 16.08,35.45 14.86,36.66 14.25,36.66 IC5.5
N$8  (via drill 0.3)
  Top 0.152: C6.2 11.12,11.9 11.12,12.13 11.96,12.97 11.96,14.11 11.73,14.34 8,14.34 7.32,13.65 Q3.1 7.47,13.88 v3.81,17.54 | v4.88,33.54 4.88,37.5 5.41,38.04 8.23,38.04 10.67,40.47 13.26,40.47 13.72,40.02 13.72,39.56 13.34,39.18 13.34,36.44 13.56,36.21 14.17,36.21 IC5.6
  Bottom 0.152: v4.88,33.54 4.88,27.29 3.81,26.23 v3.81,17.54
N$13
  Top 0.152: C19.1 30.1,38.27 29.95,38.27 29.26,37.58 27.81,37.58 27.28,38.11 26.06,38.11 IC5.47
N$17
  Top 0.152: IC8.16 23.93,8.55 24.84,8.55 25.98,9.69 26.29,9.69 C34.1 26.36,9.69 27.58,8.47 29.49,8.47 C35.+
N$19
  Top 0.152: C24.1 22.25,24.63 22.25,24.85 23.01,25.62 23.01,27.98 23.39,28.36 23.39,28.97 IC5.31
N$55  (via drill 0.3)
  Top 0.305: v25.38,65.24 24.31,66.31 21.03,66.31 R11.2 | v33.6,65.24 36.5,68.14 C2.+ | v19.96,59.14 17.75,56.93 IC2.2
  Bottom 0.305: v25.38,65.24 v33.6,65.24 38.33,60.52 38.33,50.84 37.87,50.38 37.26,50.38 28.42,59.22 22.33,59.22 21.95,59.6 21.34,59.6 20.88,59.14 v19.96,59.14
N$59
  Top 0.152: Q4.1 33.3,23.25 33.22,23.33 29.57,23.33 C47.2 29.57,23.25 25.53,19.22 25.53,15.79 24.77,15.02 23.93,15.02 IC8.26
N$60  (via drill 0.3)
  Top 0.152: C48.2 29.49,11.9 29.34,11.9 28.65,12.59 25.68,12.59 25.53,12.43 25.53,11.29 25.98,10.83 28.5,10.83 28.8,10.53 31.39,10.53 33.3,12.43 33.3,13.58 Q4.2 33.22,13.58 28.8,18 v28.42,18 | v22.33,15.02 22.94,14.41 23.85,14.41 IC8.25 | v24.23,18 v23.32,17.08
  Bottom 0.152: v22.33,15.02 22.33,16.09 v23.32,17.08 | v28.42,18 v24.23,18
N$74
  Top 0.152: JP69.1 1.29,3.52 16.38,3.52 17.6,4.74 19.51,4.74 20.65,3.59 JP70.2
PITCH_POT  (via drill 0.3)
  Top 0.152: v15.39,35.22 14.86,34.68 14.25,34.68 IC5.9 | v21.64,58.84 v19.89,57.09
  Bottom 0.152: v15.39,35.22 15.39,36.06 12.04,39.41 12.04,42.08 19.89,49.92 v19.89,57.09 | v21.64,58.84 28.19,58.84 38.71,48.32 38.71,41.62 JP45.1
PLAY  (via drill 0.3)
  Top 0.152: v20.19,39.1 19.43,39.87 19.43,40.86 IC5.58 | v24.77,34.53 v23.39,35.9 | v22.02,12.2 16.15,18.07 4.19,18.07 4.04,18.22 3.28,18.22 1.29,16.24 JP50.1
  Bottom 0.152: v23.39,35.9 v20.19,39.1 | v24.77,34.53 26.67,34.53 30.25,30.95 30.25,14.26 28.19,12.2 v22.02,12.2
POSITION_POT_CV  (via drill 0.3)
  Top 0.152: v10.52,30.42 12.04,30.42 12.72,31.1 14.17,31.1 IC5.16
  Bottom 0.152: v10.52,30.42 10.52,32.32 1.29,41.54 JP60.1
REC  (via drill 0.3)
  Top 0.152: v21.72,38.95 21.18,38.42 19.96,38.42 18.97,39.41 18.97,40.86 IC5.59 | v23.24,38.95 23.7,38.95 23.85,39.1 30.79,39.1 v32.38,37.5 | v35.97,25.69 36.88,25.69 38.71,23.86 JP49.1
  Bottom 0.152: v23.24,38.95 v21.72,38.95 | v32.38,37.5 32.38,33.54 33.3,32.63 34.37,32.63 35.97,31.03 v35.97,25.69
RESET  (via drill 0.3)
  Top 0.152: R17.1 6.1,37.2 6.63,37.2 8,35.83 SW5.B | 13.03,35.75 8.08,35.75 SW5.B | 13.03,35.75 14.17,35.75 IC5.7 | 13.03,35.75 v13.03,39.79 | v8,31.64 8,29.04 SW5.B' | v8,33.62 8,35.75 SW5.B
  Bottom 0.152: v13.03,39.79 16,42.76 17.53,42.76 17.75,42.53 19.51,42.53 21.64,44.67 21.64,45.12 25.07,48.55 25.07,48.7 JP2.10 | v8,33.62 v8,31.64
RIN
  Top 0.152: IC8.19 23.93,10.45 25.68,10.45 25.76,10.53 28.35,10.53 28.65,10.22 32.46,10.22 32.92,10.68 34.44,10.68 37.26,13.5 37.26,17.23 38.71,18.68 JP37.1
ROUT
  Top 0.152: JP38.1 37.57,15.02 37.57,13.35 34.59,10.38 33.07,10.38 32.31,9.61 32.31,9.23 30.02,6.95 23.32,6.95 21.79,8.47 16.46,8.47 IC8.13
RX
  Top 0.152: JP1.4 33.3,33.62 29.18,33.62 26.67,36.13 26.06,36.13 IC5.43
SIZE_CV
  Top 0.152: IC5.15 14.17,31.71 12.95,31.71 12.34,32.32 4.34,32.32 1.29,29.27 1.29,28.89 JP54.1
SIZE_POT
  Top 0.152: IC5.8 14.17,35.14 10.44,35.14 8.15,32.85 2.36,32.85 1.29,33.92 JP46.1
SW_LOAD
  Top 0.152: JP41.1 34.98,37.73 33.3,37.73 31.62,39.41 23.77,39.41 22.94,40.25 22.94,40.86 IC5.51
SW_MODE  (via drill 0.3)
  Top 0.152: v19.05,38.42 19.36,38.11 21.79,38.11 22.4,38.72 IC5.52 | v19.05,35.45 19.05,35.06 v21.26,32.85 | v6.86,27.9 6.86,28.74 4.72,30.87 3.35,30.87 2.44,29.96 2.44,27.52 JP42.1
  Bottom 0.152: v19.05,35.45 v19.05,38.42 | v21.26,32.85 21.26,31.48 17.45,27.67 9.6,27.67 9.37,27.9 v6.86,27.9
SW_REC  (via drill 0.3)
  Top 0.152: v17.91,38.65 IC5.61 | v18.36,37.05 21.95,33.46 v21.95,32.17
  Bottom 0.152: v17.91,38.65 17.91,37.5 v18.36,37.05 | v21.95,32.17 21.95,29.81 13.49,21.35 13.49,14.57 12.57,13.65 JP48.1
TEXTURE_CV  (via drill 0.3)
  Top 0.152: v13.03,33.08 13.03,32.78 13.56,32.25 14.17,32.25 IC5.14 | v29.57,30.72 32.69,30.72 33.3,30.11 37.49,30.11 38.71,28.89 JP53.1
  Bottom 0.152: v13.03,33.08 15.01,33.08 15.16,32.93 19.89,32.93 20.8,33.85 26.44,33.85 v29.57,30.72
TEXTURE_POT  (via drill 0.3)
  Top 0.152: v19.05,30.19 18.97,30.11 18.97,29.04 IC5.22
  Bottom 0.152: v19.05,30.19 17.83,30.19 16.69,29.04 9.68,29.04 5.56,33.16 5.56,33.77 4.95,34.38 2.9,34.38 2.44,33.92 2.44,32.63 1.29,31.48 JP58.1
TX
  Top 0.152: IC5.42 26.06,35.67 26.67,35.67 30.86,31.48 33.6,31.48 JP1.5
V_OCT  (via drill 0.3)
  Top 0.152: v24.54,32.78 23.24,31.48 21.72,31.48 20.57,32.63 18.67,32.63 17.91,31.86 17.91,29.04 IC5.20 | v26.52,29.5 27.74,29.5 30.86,26.38 38.71,26.38 JP56.1
  Bottom 0.152: v24.54,32.78 24.54,32.32 26.52,30.34 v26.52,29.5
VCC  (via drill 0.3)
  Top 0.305: v16.38,66.31 19.28,66.31 R11.1 | 29.95,53.96 28.19,55.71 14.94,55.71 11.96,58.69 11.96,61.73 v11.89,61.81 10.82,61.81 D1.- 10.67,61.89 4.42,68.14 3.81,68.14 C1.+ | 29.95,53.96 30.56,53.35 30.56,52.44 IC7.3 | v30.1,54.04 30.02,54.04 29.95,53.96
  Bottom 0.305: JP70.1 23.24,3.59 31.24,3.59 38.71,11.06 JP61.1 38.63,11.21 38.63,11.98 36.73,13.88 36.73,36.44 34.9,38.27 34.9,49.24 v30.1,54.04 | v11.89,61.81 v16.38,66.31
VEE  (via drill 0.3)
  Top 0.305: 11.73,49.47 11.73,48.17 R30.1 | 11.73,49.47 3.81,57.39 C13.- | 31.47,51.07 31.62,51.22 31.62,58.69 29.57,60.74 29.57,61.73 D2.+ | 31.47,51.07 29.72,51.07 29.34,51.45 29.34,53.89 28.12,55.11 17.37,55.11 11.73,49.47 | v37.19,37.05 37.19,45.35 31.47,51.07
  Bottom 0.305: v37.19,37.05 37.19,15.94 38.71,14.41 38.71,13.65 JP62.1

### Text on the board
bPlace: V1.1 | POWER | DESIGN BY OLIVIER GILLET / REDESIGN BY DAVID SZEBENYI | ANTUMBRA | SMOG | JACK LIGHTS | OFF | ON
tNames: SYSBOOT | RESET
bNames: JTAG | FTDI | GND | <TX | cc-by-sa Olivier Gillet, 2015. v3